# Altium schematic sheet jn5169 module_blk.SchDoc
size A4; Engineer: JBayalas; DocumentNumber: 10; Revision: V5.0.0; SheetNumber: 10; SheetTotal: 13
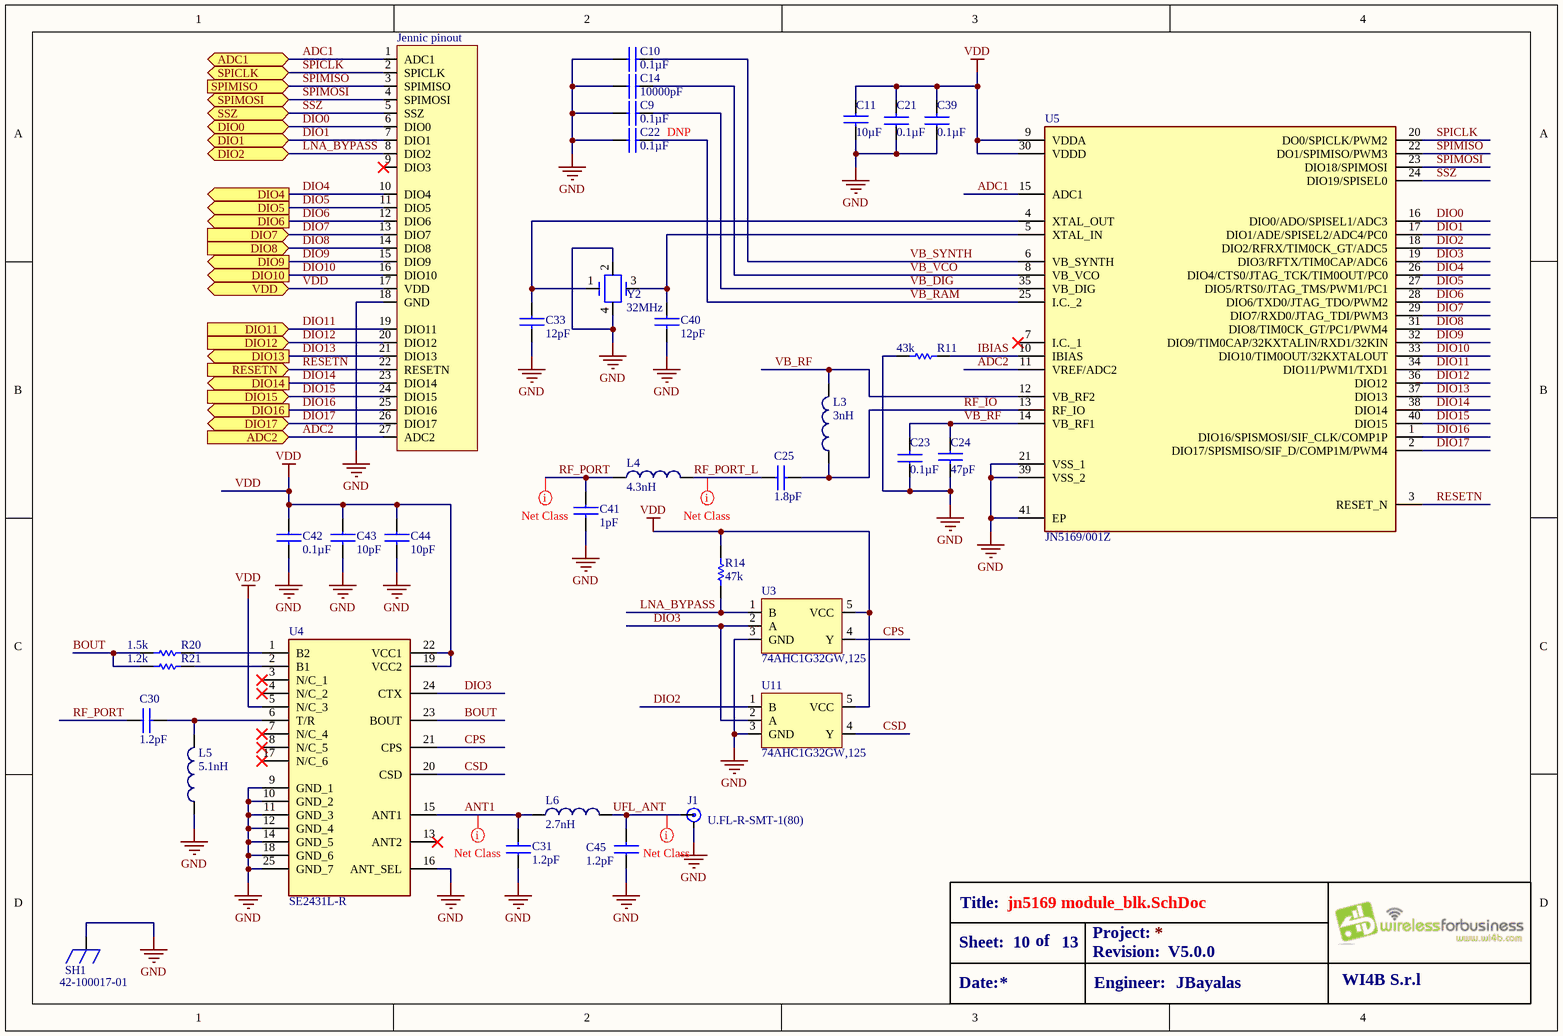
[diagram p0: jn5169 module_blk.SchDoc]

## Parts
C9  value 0.1µF  [C0402]  (hidden comment: GRM155R61A104KA01D)
C10  value 0.1µF  [C0402]  (hidden comment: GRM155R61A104KA01D)
C11  value 10µF  [CAPC2012X135N]  (hidden comment: GRT21BR61A106KE01L)
C14  value 10000pF  [C0402]  (hidden comment: GRM155R71E103KA01D)
C21  value 0.1µF  [C0402]  (hidden comment: GRM155R61A104KA01D)
C22  value 0.1µF  LOAD: DNP  [C0402]  (hidden comment: GRM155R61A104KA01D)
C23  value 0.1µF  [C0402]  (hidden comment: GRM155R61A104KA01D)
C24  value 47pF  [CAPC1005X55N]  (hidden comment: GRM1555C1H470JA01D)
C25  value 1.8pF  [CAPC1005X55N]  (hidden comment: GRM1555C1H1R8CA01D)
C30  value 1.2pF  [CAPC1005X55N]  (hidden comment: GRM1555C1H1R2CA01D)
C31  value 1.2pF  [CAPC1005X55N]  (hidden comment: GRM1555C1H1R2CA01D)
C33  value 12pF  [CAPC1005X55N]  (hidden comment: GRM1555C1H120JA01D)
C39  value 0.1µF  [C0402]  (hidden comment: GRM155R61A104KA01D)
C40  value 12pF  [CAPC1005X55N]  (hidden comment: GRM1555C1H120JA01D)
C41  value 1pF  [CAPC1005X55N]  (hidden comment: GRM1555C1H1R0CA01D)
C42  value 0.1µF  [C0402]  (hidden comment: GRM155R61A104KA01D)
C43  value 10pF  [C0402]  (hidden comment: GRM1555C1H100JA01D)
C44  value 10pF  [C0402]  (hidden comment: GRM1555C1H100JA01D)
C45  value 1.2pF  [CAPC1005X55N]  (hidden comment: GRM1555C1H1R2CA01D)
J1  U.FL-R-SMT-1(80)  [HIROSE_U.FL-R-SMT]
Jennic_pinout  Jennic pinout  [JN516X PINOUT]  (value not drawn)
L3  value 3nH  [INDC1005X45N]  (hidden comment: LQP15MN3N0B02D)
L4  value 4.3nH  [INDC1005X45N]  (hidden comment: LQP15MN4N3B02D)
L5  value 5.1nH  [INDC1005X45N]  (hidden comment: LQP15MN5N1B02D)
L6  value 2.7nH  [INDC1005X45N]  (hidden comment: LQP15MN2N7B02D)
R11  value 43k  [RESC1005X40N]  (hidden comment: RC0402FR-0743KL)
R14  value 47k  [R0402]  (hidden comment: RC0402FR-0747KL)
R20  value 1.5k  [RESC1005X40N]  (hidden comment: RC0402FR-071K5L)
R21  value 1.2k  [RESC1005X40N]  (hidden comment: RC0402FR-071K2L)
SH1  42-100017-01  [42-100017-01(Shield)]
U3  74AHC1G32GW,125  [SOT65P210X110-5N]
U4  SE2431L-R  [QFN40P300X400X90-25N-D]
U5  JN5169/001Z  [QFN50P600X600X100-41N]
U11  74AHC1G32GW,125  [SOT65P210X110-5N]
Y2  value 32MHz  [OSCCC320X250X80L75X100N]  (hidden comment: ABM8-32.000MHZ-9-D1G-T)

## Ports
ADC1 (bidir), ADC2 (in), DIO0 (bidir), DIO1 (bidir), DIO2 (bidir), DIO4 (out), DIO5 (out), DIO6 (out), DIO7 (in), DIO8 (in), DIO9 (out), DIO10 (out), DIO11 (in), DIO12 (in), DIO13 (out), DIO14 (out), DIO15 (in), DIO16 (out), DIO17 (bidir), RESETN (in), SPICLK (bidir), SPIMISO (in), SPIMOSI (bidir), SSZ (bidir), VDD (bidir)

## Nets
GND: C9.1 C10.1 C11.2 C14.1 C21.1 C22.1 C23.1 C24.2 C31.1 C33.2 C39.1 C40.2 C41.2 C42.2 C43.2 C44.2 C45.1 J1.2(GND) Jennic_pinout.18(GND) L5.2 R11.1 SH1.1 U3.3(GND) U4.9(GND_1) U4.10(GND_2) U4.11(GND_3) U4.12(GND_4) U4.14(GND_5) U4.16(ANT_SEL) U4.18(GND_6) U4.25(GND_7) U5.21(VSS_1) U5.39(VSS_2) U5.41(EP) U11.3(GND) Y2.2 Y2.4
VDD: C11.1 C21.2 C39.2 C42.1 C43.1 C44.1 Jennic_pinout.17(VDD) R14.2 U3.5(VCC) U4.5(N/C_3) U4.19(VCC2) U4.22(VCC1) U5.9(VDDA) U5.30(VDDD) U11.5(VCC) ; port VDD
ADC1: Jennic_pinout.1(ADC1) U5.15(ADC1) ; port ADC1
ADC2: Jennic_pinout.27(ADC2) U5.11(VREF/ADC2) ; port ADC2
ANT1: C31.2 L6.2 U4.15(ANT1)
BOUT: R20.1 R21.1 U4.23(BOUT)
CPS: U3.4(Y) U4.21(CPS)
CSD: U4.20(CSD) U11.4(Y)
DIO0: Jennic_pinout.6(DIO0) U5.16(DIO0/ADO/SPISEL1/ADC3) ; port DIO0
DIO1: Jennic_pinout.7(DIO1) U5.17(DIO1/ADE/SPISEL2/ADC4/PC0) ; port DIO1
DIO2: U5.18(DIO2/RFRX/TIM0CK_GT/ADC5) U11.1(B)
DIO3: U3.2(A) U4.24(CTX) U5.19(DIO3/RFTX/TIM0CAP/ADC6) U11.2(A)
DIO4: Jennic_pinout.10(DIO4) U5.26(DIO4/CTS0/JTAG_TCK/TIM0OUT/PC0) ; port DIO4
DIO5: Jennic_pinout.11(DIO5) U5.27(DIO5/RTS0/JTAG_TMS/PWM1/PC1) ; port DIO5
DIO6: Jennic_pinout.12(DIO6) U5.28(DIO6/TXD0/JTAG_TDO/PWM2) ; port DIO6
DIO7: Jennic_pinout.13(DIO7) U5.29(DIO7/RXD0/JTAG_TDI/PWM3) ; port DIO7
DIO8: Jennic_pinout.14(DIO8) U5.31(DIO8/TIM0CK_GT/PC1/PWM4) ; port DIO8
DIO9: Jennic_pinout.15(DIO9) U5.32(DIO9/TIM0CAP/32KXTALIN/RXD1/32KIN) ; port DIO9
DIO10: Jennic_pinout.16(DIO10) U5.33(DIO10/TIM0OUT/32KXTALOUT) ; port DIO10
DIO11: Jennic_pinout.19(DIO11) U5.34(DIO11/PWM1/TXD1) ; port DIO11
DIO12: Jennic_pinout.20(DIO12) U5.36(DIO12) ; port DIO12
DIO13: Jennic_pinout.21(DIO13) U5.37(DIO13) ; port DIO13
DIO14: Jennic_pinout.23(DIO14) U5.38(DIO14) ; port DIO14
DIO15: Jennic_pinout.24(DIO15) U5.40(DIO15) ; port DIO15
DIO16: Jennic_pinout.25(DIO16) U5.1(DIO16/SPISMOSI/SIF_CLK/COMP1P) ; port DIO16
DIO17: Jennic_pinout.26(DIO17) U5.2(DIO17/SPISMISO/SIF_D/COMP1M/PWM4) ; port DIO17
IBIAS: R11.2 U5.10(IBIAS)
LNA_BYPASS: Jennic_pinout.8(DIO2) R14.1 U3.1(B) ; port DIO2
RESETN: Jennic_pinout.22(RESETN) U5.3(RESET_N) ; port RESETN
RF_IO: C25.2 L3.2 U5.13(RF_IO)
RF_PORT: C30.1 C41.1 L4.2
RF_PORT_L: C25.1 L4.1
SPICLK: Jennic_pinout.2(SPICLK) U5.20(DO0/SPICLK/PWM2) ; port SPICLK
SPIMISO: Jennic_pinout.3(SPIMISO) U5.22(DO1/SPIMISO/PWM3) ; port SPIMISO
SPIMOSI: Jennic_pinout.4(SPIMOSI) U5.23(DIO18/SPIMOSI) ; port SPIMOSI
SSZ: Jennic_pinout.5(SSZ) U5.24(DIO19/SPISEL0) ; port SSZ
UFL_ANT: C45.2 J1.1(SIGNAL) L6.1
VB_DIG: C9.2 U5.35(VB_DIG)
VB_RAM: C22.2 U5.25(I.C._2)
VB_RF: C23.2 C24.1 L3.1 U5.12(VB_RF2) U5.14(VB_RF1)
VB_SYNTH: C10.2 U5.6(VB_SYNTH)
VB_VCO: C14.2 U5.8(VB_VCO)
NetC30_2: C30.2 L5.1 U4.6(T/R)
NetC33_1: C33.1 U5.4(XTAL_OUT) Y2.1
NetC40_1: C40.1 U5.5(XTAL_IN) Y2.3
NetR20_2: R20.2 U4.1(B2)
NetR21_2: R21.2 U4.2(B1)

Not connected (* = marked no-connect by the designer): Jennic_pinout 9(DIO3)*; U4 3(N/C_1)* 4(N/C_2)* 7(N/C_4)* 8(N/C_5)* 13(ANT2)* 17(N/C_6)*; U5 7(I.C._1)*

## Layout directives
net class 50Ohms: ANT1, RF_PORT, RF_PORT_L, UFL_ANT

## Notes on the sheet
- Title:
- Sheet:
- Date:
- of
- Project:
- Revision:
- Engineer:
- WI4B S.r.l

## Library data of the parts
C9 C10 C21-C23 C39 C42 = GRM155R61A104KA01D: CAP CER 0.1UF 10V 10% X5R 0402; MFT: Murata Electronics North America; TYPE: Surface Mount; FUNCTION: JN5169 MOD; MPN: GRM155R61A104KA01D; RATING: 10V
C11 = GRT21BR61A106KE01L: CAP CER 10UF 10V X5R 0805; MFT: Murata; TYPE: SMD; FUNCTION: JN5169 MOD; MPN: GRT21BR61A106KE01L; LOAD: *; RATING: 10V; APN: *
C14 = GRM155R71E103KA01D: CAP CER 10000PF 25V X7R 0402; MFT: Murata Electronics North America; TYPE: SMD; FUNCTION: JN5169 MOD; MPN: GRM155R71E103KA01D; RATING: 25V; LOAD: *
C24 = GRM1555C1H470JA01D: CAP CER 47PF 50V C0G/NP0 0402; MFT: Murata; TYPE: SMD; FUNCTION: JN5169 MOD; MPN: GRM1555C1H470JA01D; APN: *; RATING: 50V; LOAD: *
C25 = GRM1555C1H1R8CA01D: CAP CER 1.8PF 50V C0G/NP0 0402; MFT: Murata; TYPE: SMD; FUNCTION: JN5169 MOD; MPN: GRM1555C1H1R8CA01D; LOAD: *; RATING: 50V; APN: *
C30 C31 C45 = GRM1555C1H1R2CA01D: CAP CER 1.2PF 50V C0G/NP0 0402; MFT: Murata; TYPE: SMD; FUNCTION: JN5169 MOD; MPN: GRM1555C1H1R2CA01D; RATING: 50V; LOAD: *; APN: *
C33 C40 = GRM1555C1H120JA01D: CAP CER 12PF 50V C0G/NP0 0402; MFT: Murata; TYPE: SMD; FUNCTION: JN5169 MOD; MPN: GRM1555C1H120JA01D; APN: *; RATING: 50V; LOAD: *
C41 = GRM1555C1H1R0CA01D: CAP CER 1PF 50V C0G/NP0 0402; MFT: Murata; TYPE: SMD; FUNCTION: JN5169 MOD; MPN: GRM1555C1H1R0CA01D; APN: *; LOAD: *; RATING: 50V
C43 C44 = GRM1555C1H100JA01D: CAP CER 10PF 50V 5% NP0 0402; MFT: Murata Electronics North America; TYPE: Surface Mount; FUNCTION: JN5169 MOD; MPN: GRM1555C1H100JA01D; RATING: 50V
J1 = U.FL-R-SMT-1(80): RF Connectors / Coaxial Connectors SMT MALE RECEPT AU; MFT: Hirose; APN: JX-001UFL-80; FUNCTION: JN5169 MOD; MPN: U.FL-R-SMT-1(80); RATING: *; LOAD: *; TYPE: SMD; VALUE: U.FL-R-SMT-1(80)
Jennic_pinout = Jennic pinout: FUNCTION: JN5169 MOD
L3 = LQP15MN3N0B02D: FIXED IND 3NH 190MA 400 MOHM SMD; MFT: Murata; APN: LZ-00030-L7-00; FUNCTION: JN5169 MOD; MPN: LQP15MN3N0B02D; RATING: *; LOAD: *; TYPE: SMD
L4 = LQP15MN4N3B02D: FIXED IND 4.3NH 160MA 600 MOHM; MFT: Murata; APN: LZ-00431-L7-00; FUNCTION: JN5169 MOD; MPN: LQP15MN4N3B02D; RATING: *; TYPE: *; LOAD: *
L5 = LQP15MN5N1B02D: Inductor RF Chip ThFIXED IND 5.1NH 140MA 700 MOHM; MFT: Murata; TYPE: SMD; APN: LZ-00511-L7-00; FUNCTION: JN5169 MOD; MPN: LQP15MN5N1B02D; RATING: *; LOAD: *
L6 = LQP15MN2N7B02D: FIXED IND 2.7NH 220MA 300 MOHM; MFT: Murata; APN: LZ-00271-L7-00; TYPE: SMD; FUNCTION: JN5169 MOD; MPN: LQP15MN2N7B02D; RATING: *; LOAD: *
R11 = RC0402FR-0743KL: RES SMD 43K OHM 1% 1/16W 0402; MFT: Yageo; APN: RQ-0433-R7-C; FUNCTION: JN5169 MOD; MPN: RC0402FR-0743KL; RATING: 1/16W; LOAD: *; TYPE: SMD
R14 = RC0402FR-0747KL: RES SMD 47K OHM 1% 1/16W 0402; MFT: Yageo; APN: RQ-0473-R7-C; FUNCTION: JN5169 MOD; MPN: RC0402FR-0747KL; LOAD: *; TYPE: SMD; RATING: 1/16W
R20 = RC0402FR-071K5L: RES SMD 1.5K OHM 1% 1/16W 0402; MFT: Yageo; APN: RQ-0154-R7-C; FUNCTION: JN5169 MOD; MPN: RC0402FR-071K5L; TYPE: SMD; RATING: 1% 1/16W; LOAD: *
R21 = RC0402FR-071K2L: RES SMD 1.2K OHM 1% 1/16W 0402; MFT: Yageo; FUNCTION: JN5169 MOD; MPN: RC0402FR-071K2L; APN: *; RATING: 1/16W; LOAD: *; TYPE: SMD
SH1 = 42-100017-01: Shield; MFT: TSC; FUNCTION: JN5169 MOD; APN: *; RATING: *; LOAD: *; TYPE: SMD; MPN: 42-100017-01; VALUE: 42-100017-01
U3 U11 = 74AHC1G32GW,125: IC GATE OR 1CH 2-INP 5TSSOP; MFT: Nexperia; APN: UE-74AHC1G32-X1; FUNCTION: JN5169 MOD; MPN: 74AHC1G32GW,125; LOAD: *; TYPE: SMD; RATING: *; VALUE: 74AHC1G32GW,125
U4 = SE2431L-R: IC RF FRONT END MOD 2.4GHZ 24QFN; MFT: Skyworks; APN: U8-SE2431L-X1; FUNCTION: JN5169 MOD; MPN: SE2431L-R; RATING: *; TYPE: SMD; LOAD: *; VALUE: SE2431L-R
U5 = JN5169/001Z: IC RF TXRX+MCU 802.15.4 40-VFQFN; MFT: NXP Semiconductors; APN: U8-JN5169-X1-01; FUNCTION: JN5169 MOD; MPN: JN5169/001Z; LOAD: *; TYPE: SMD; RATING: *; VALUE: JN5169/001Z
Y2 = ABM8-32.000MHZ-9-D1G-T: CRYSTAL 32.0000MHZ 9PF SMD; MFT: Abracon; APN: XZ-00326FH; FUNCTION: JN5169 MOD; MPN: ABM8-32.000MHZ-9-D1G-T; RATING: *; LOAD: *; TYPE: SMD